# Altium schematic sheet DS214SD.SchDoc: DS214SD
size A4; Organization: LES-TV; Address1: Moscow; Address2: www.les.ru; Revision: 4.0; SheetNumber: 1; SheetTotal: 2
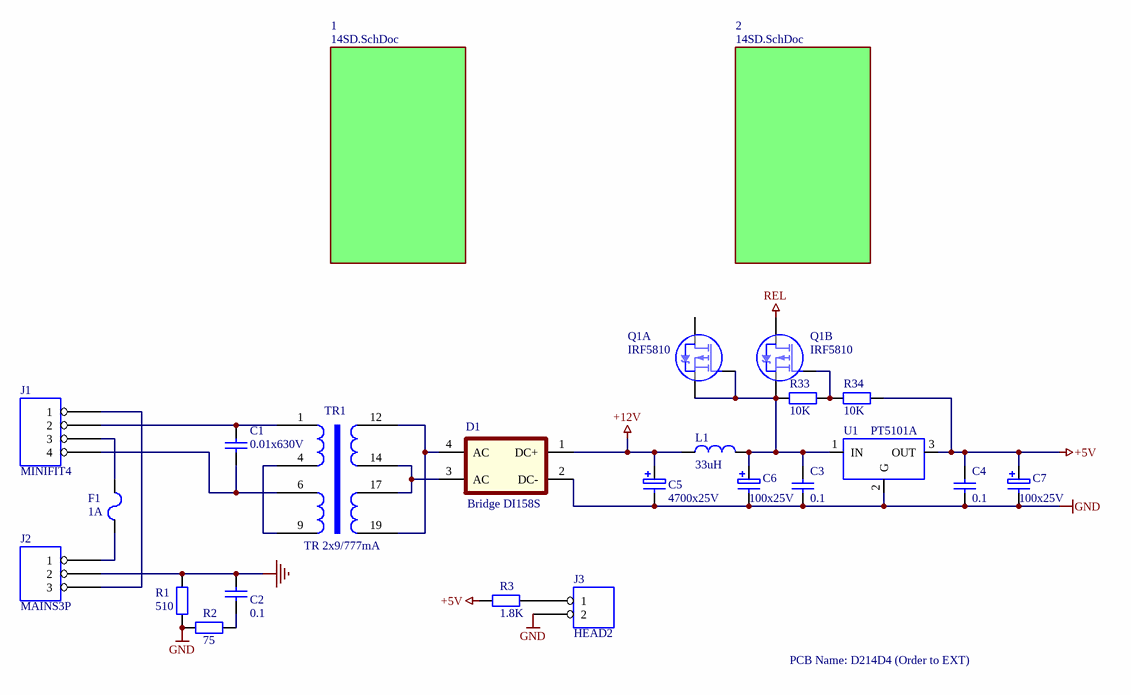
[diagram p0: DS214SD.SchDoc]

## Parts
C1  0.01x630V  [C100N]
C2  0.1  [C0805]
C3  0.1  [C0805]
C4  0.1  [C0805]
C5  4700x25V  [CPOL75L]
C6  100x25V  [CPOL25]
C7  100x25V  [CPOL25]
D1  Bridge DI158S  [SDIP]
F1  1A  [FUSE]
J1  MINIFIT4  [MINIFIT4]
J2  MAINS3P  [MAINS3P]
J3  HEAD2  [2SIP100]
L1  33uH  [L050]
Q1  IRF5810  [TSOP6]  (parts A,B of 2)
R1  510  [R0805]
R2  75  [R0805]
R3  1.8K  [R0805]
R33  10K  [R0805]
R34  10K  [R0805]
TR1  TR 2x9/777mA  [TR14VA]
U1  PT5101A  [PT5101A-LOW]

## Sub-sheets
1 = 14SD.SchDoc: no entries
2 = 14SD.SchDoc: no entries

## Nets
+5V: C4.2 C7.1 R3.1 R34.2 U1.3(OUT)
+12V: C5.1 D1.1(DC+) L1.1
GND: C3.1 C4.1 C5.2 C6.2 C7.2 D1.2(DC-) J3.2 R1.1 R2.1 U1.2(G)
GNE: C2.2 J2.2 R1.2
REL: Q1.4(D2)
NetC1_1: C1.1 J1.4 TR1.6
NetC1_2: C1.2 J1.2 TR1.1
NetC2_1: C2.1 R2.2
NetC3_2: C3.2 C6.1 L1.2 Q1.1(G1) Q1.2(S2) Q1.5(S1) R33.1 U1.1(IN)
NetD1_3: D1.3(AC) TR1.14 TR1.17
NetD1_4: D1.4(AC) TR1.12 TR1.19
NetF1_1: F1.1 J2.1
NetF1_2: F1.2 J1.3
NetJ1_1: J1.1 J2.3
NetJ3_1: J3.1 R3.2
NetQ1_3: Q1.3(G2) R33.2 R34.1
NetTR1_4: TR1.4 TR1.9

Not connected (* = marked no-connect by the designer): Q1 6(D1)

## Notes on the sheet
- PCB Name: D214D4 (Order to EXT)
- Title
- Size:
- Date:
- A4
- Number:
- Time:
- Revision:
- Sheet
- of
- File:

## Library data of the parts
C1-C4 = Cap: Capacitor; Manufacturer: Generic Components; Class I: Passive; Rule: Undefined; Published: 8-Jun-2000; Revision: July-2002: Re-released for DXP Platform.; Publisher: Altium Limited; Class II: Capacitor
  C1: Value: 0.01x630V
  C2-C4: Value: 0.1
C5-C7 = Cap Pol: Polarized Capacitor (Radial); Manufacturer: Generic Components; Class I: Passive; Published: 8-Jun-2000; Revision: July-2002: Re-released for DXP Platform.; Publisher: Altium Limited; Class II: Capacitor
  C5: Value: 4700x25V
  C6 C7: Value: 100x25V
F1 = Fuse
J1 = HEAD4: Right: 30; Bottom: 30
J2 = HEAD3: Right: 30; Bottom: 30
J3 = HEAD2: Right: 30; Bottom: 30
L1 = INDUCTOR: Right: 20; Bottom: 40
Q1 = IRF5810: P-Channel MOSFET; Published: 8-Jun-2000; Revision: July-2002: Re-released for DXP Platform.; Publisher: Altium Limited
R1-R3 R33 R34 = Res: Resistor; Manufacturer: Generic Components; Class I: Passive; Published: 8-Jun-2000; Revision: July-2002: Re-released for DXP Platform.; Publisher: Altium Limited; Class II: Resistor
  R1: Value: 510
  R2: Value: 75
  R3: Value: 1.8K
  R33 R34: Value: 10K
U1 = PT5101A: Right: 60; Bottom: 30